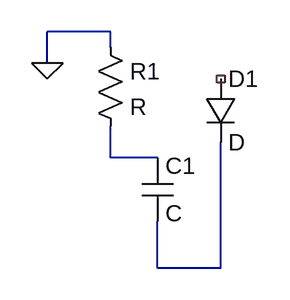
[diagram p0: schematic Domaci1.asc]
Domaci1.asc, the LTspice schematic file:
Version 4
SHEET 1 880 680
WIRE 224 16 160 16
WIRE 224 32 224 16
WIRE 160 48 160 16
WIRE 224 144 224 112
WIRE 272 144 224 144
WIRE 272 256 272 208
WIRE 336 256 336 128
WIRE 336 256 272 256
FLAG 160 48 0
SYMBOL res 208 16 R0
SYMATTR InstName R1
SYMBOL cap 256 144 R0
SYMATTR InstName C1
SYMBOL diode 320 64 R0
SYMATTR InstName D1

The netlist it stands for:
* Domaci1.asc
R1 0 N001 R
C1 N001 N002 C
D1 NC_01 N002 D
.model D D
.lib standard.dio
.backanno
.end